# EAGLE schematic Panelizado_frentes_TOP (EAGLE 9.6.2)

## Sheet 1 of 2: Panel Frontal
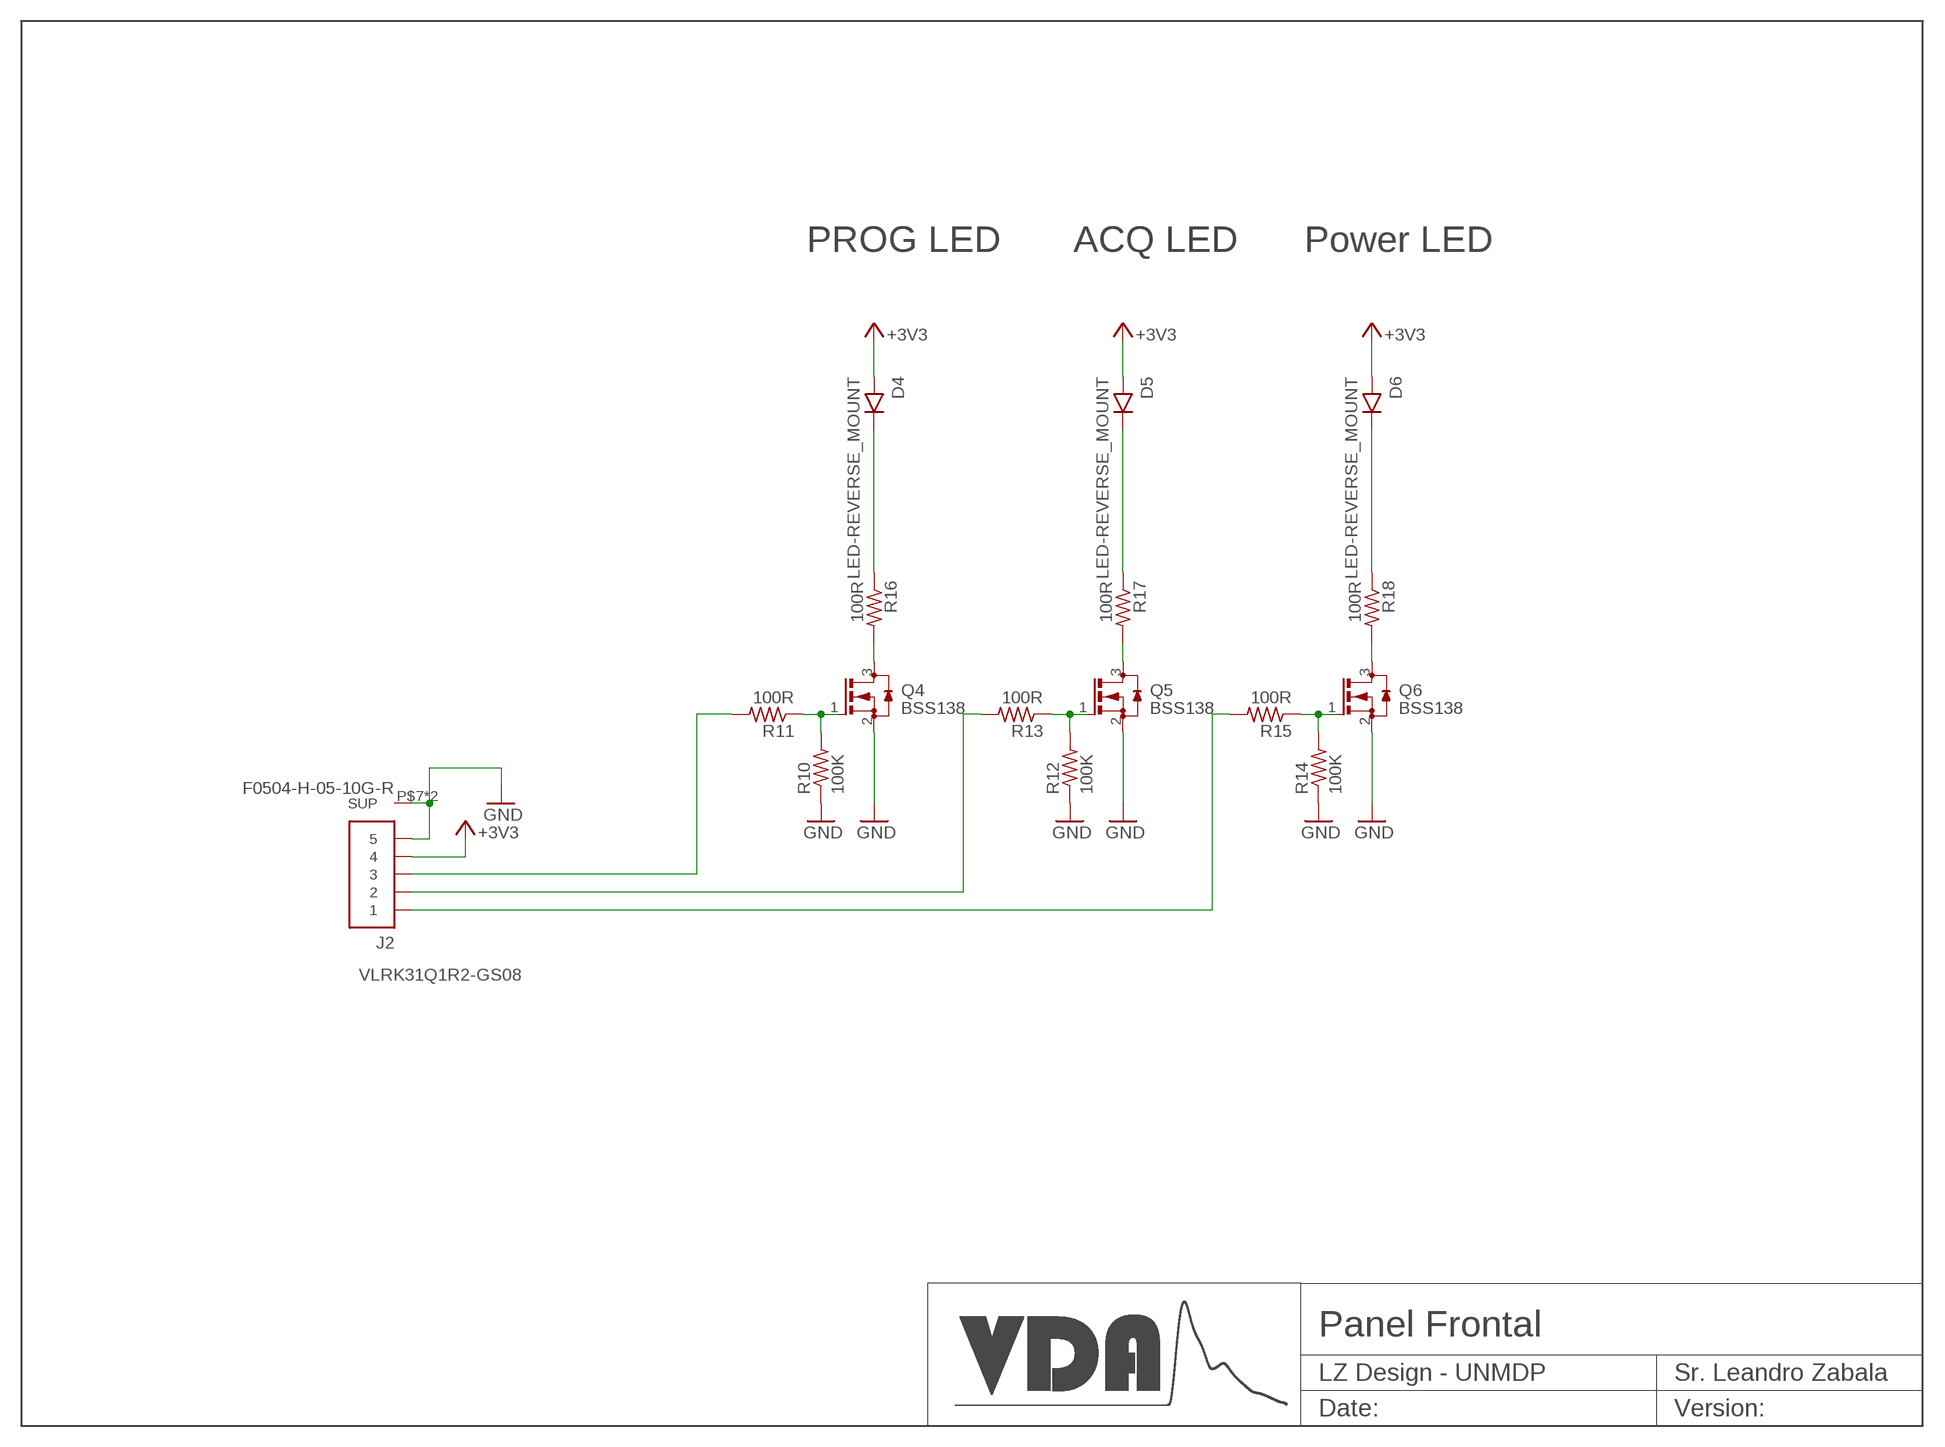
[diagram p0: schematic, sheet 1]

### Parts
D4  LED-REVERSE_MOUNT  [VLRK31]
D5  LED-REVERSE_MOUNT  [VLRK31]
D6  LED-REVERSE_MOUNT  [VLRK31]
J2  F0504-H-05-10G-R  [F0504-H-05-10G-R]
Q4  BSS138  N-MOS_SOT23-3  [SOT-23]
Q5  BSS138  N-MOS_SOT23-3  [SOT-23]
Q6  BSS138  N-MOS_SOT23-3  [SOT-23]
R10  100K  R_0603  [R_0603]
R11  100R  R_0603  [R_0603]
R12  100K  R_0603  [R_0603]
R13  100R  R_0603  [R_0603]
R14  100K  R_0603  [R_0603]
R15  100R  R_0603  [R_0603]
R16  100R  R_0603  [R_0603]
R17  100R  R_0603  [R_0603]
R18  100R  R_0603  [R_0603]

### Nets
+3V3: D4.A D5.A D6.A J2.P$4
GND: J2.P$5 J2.P$7(SUP) J2.P$8(SUP) Q4.2(S) Q5.2(S) Q6.2(S) R10.1 R12.1 R14.1
N$13: Q4.1(G) R10.2 R11.1
N$14: Q5.1(G) R12.2 R13.1
N$15: Q6.1(G) R14.2 R15.1
N$16: J2.P$3 R11.2
N$17: J2.P$2 R13.2
N$18: J2.P$1 R15.2
N$19: D4.K R16.1
N$20: Q4.3(D) R16.2
N$21: D5.K R17.1
N$22: Q5.3(D) R17.2
N$23: D6.K R18.1
N$24: Q6.3(D) R18.2

### Notes on the sheet
- PROG LED | ACQ LED | Power LED
- VLRK31Q1R2-GS08

## Sheet 2 of 2
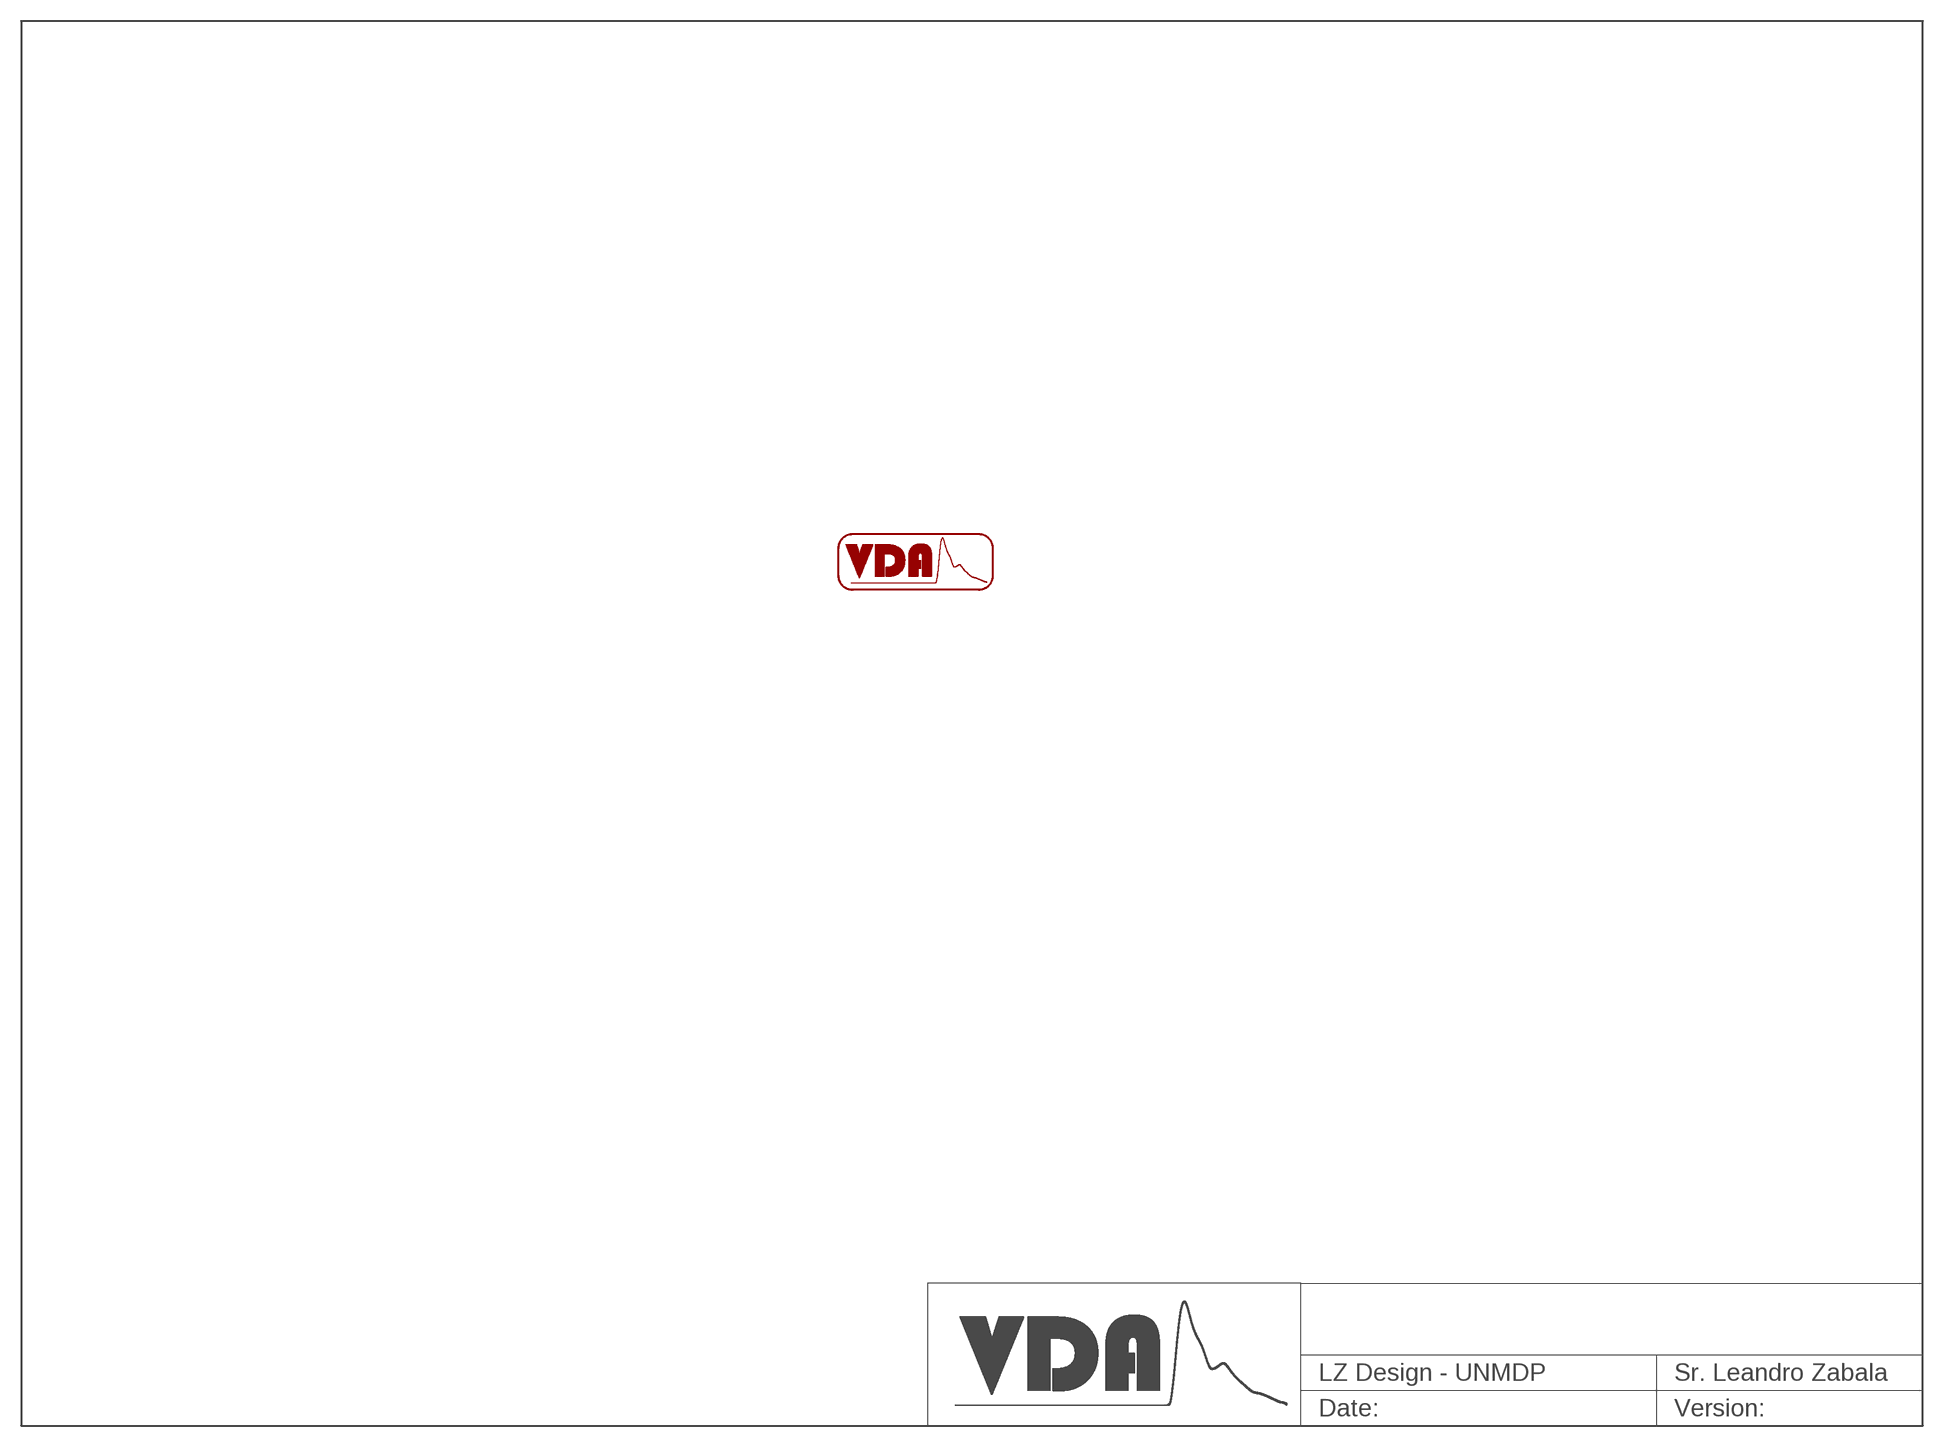
[diagram p1: schematic, sheet 2]

### Parts
U$1  LOGO_VDA-3CM  [LOGO_VDA-3CM]

## Library data of the parts
D4-D6 = property_LED:LED-REVERSE_MOUNT
J2 = property-connectors:F0504-H-05-10G-R: FFC, FPC (Flat Flexible) Connector SMD,P=0.5mm,Surface Mount，Right Angle
Q4-Q6 = Property-standar:N-MOS
R10-R18 = Property-standar:R
U$1 = Frames:LOGO_VDA